# Altium schematic sheet Top_Level.SchDoc: FMC interface to FPGA - Top Level
size A4; Date: 27.09.2023; ApprovedBy: M.Sc. Tobias Wirth; CheckedBy: M.Sc. Tobias Wirth; Author: M.Sc. Tobias Wirth; CompanyName: University of Stuttgart; DrawnBy: M.Sc. Tobias Wirth; Engineer: M.Sc. Tobias Wirth; Organization: IIS; Address1: Pfaffenwaldring 47; Address2: 70569 Stuttgart; Revision: V1.1; SheetNumber: 1; SheetTotal: 17; ProjectNameAlt: AUS - NMR System; Time: 10:00; ImagePath: N/A; Application_BuildNumber: N/A
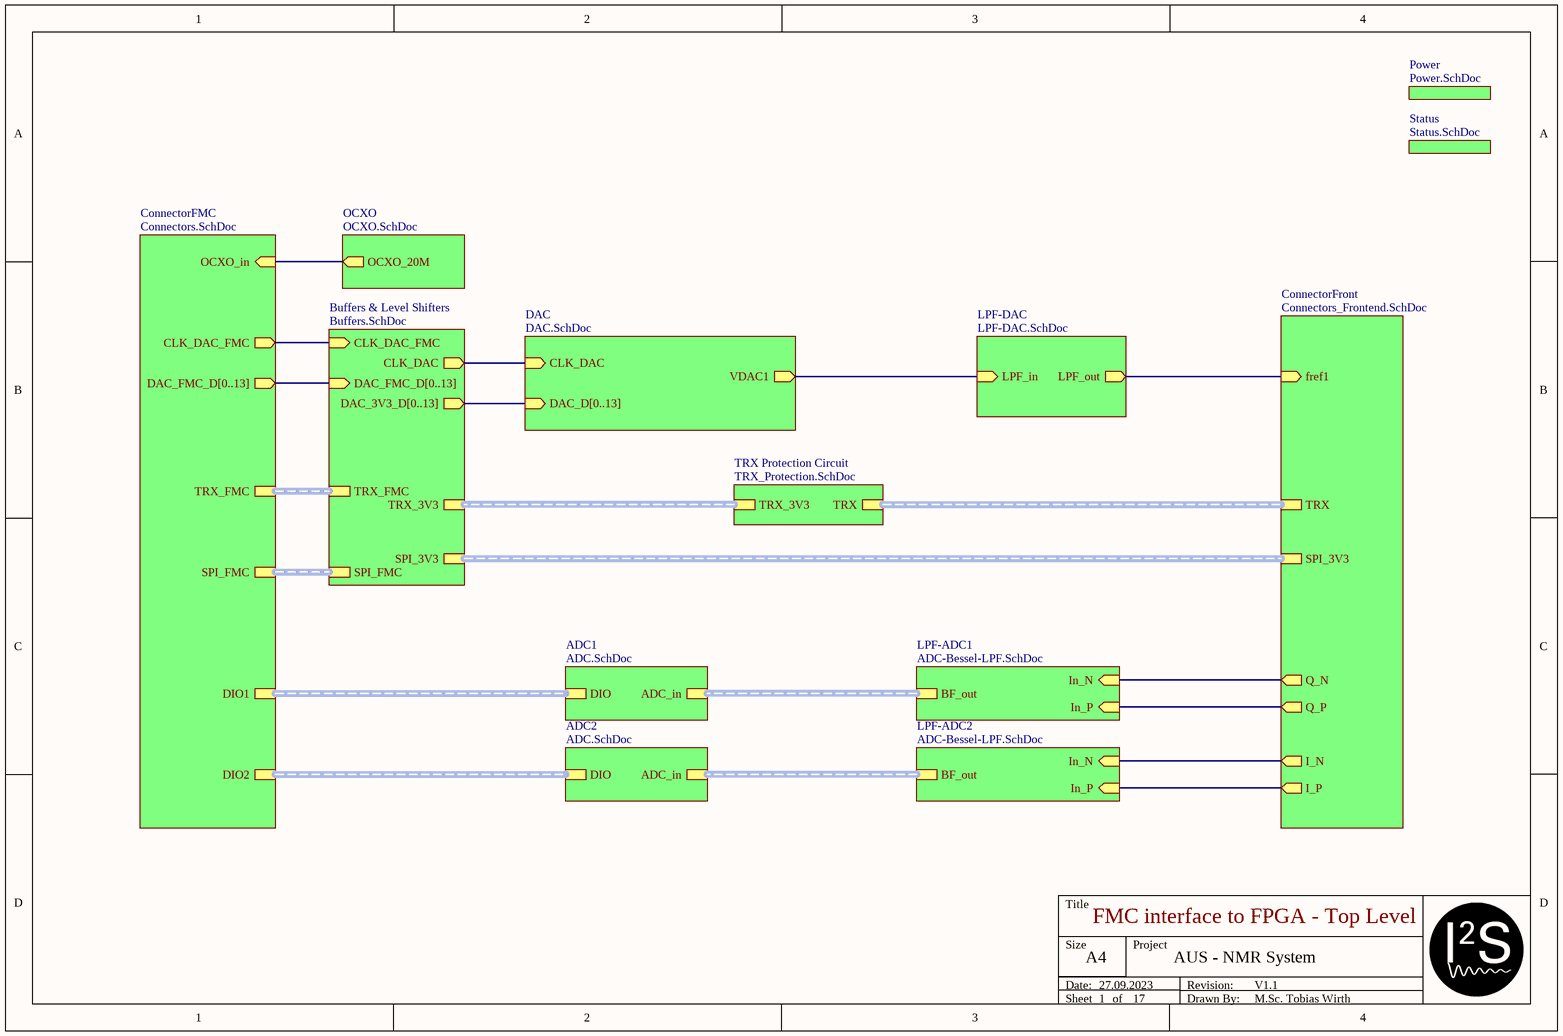
[diagram p0: Top_Level.SchDoc]

## Sub-sheets
ADC1 = ADC.SchDoc: DIO (harness DIO), ADC_in (harness ADC_IN)
ADC2 = ADC.SchDoc: DIO (harness DIO), ADC_in (harness ADC_IN)
Buffers & Level Shifters = Buffers.SchDoc: DAC_FMC_D[0..13] (in), CLK_DAC_FMC (in), TRX_FMC (harness TRX_FMC), SPI_FMC (harness SPI_FMC), CLK_DAC (out), DAC_3V3_D[0..13] (out), TRX_3V3 (harness TRX_3V3), SPI_3V3 (harness SPI_3V3)
ConnectorFMC = Connectors.SchDoc: DIO1 (harness DIO), DIO2 (harness DIO), DAC_FMC_D[0..13] (out), CLK_DAC_FMC (out), OCXO_in (in), TRX_FMC (harness TRX_FMC), SPI_FMC (harness SPI_FMC)
ConnectorFront = Connectors_Frontend.SchDoc: fref1 (in), Q_P (out), Q_N (out), I_P (out), I_N (out), TRX (harness TRX), SPI_3V3 (harness SPI_3V3)
DAC = DAC.SchDoc: VDAC1 (out), CLK_DAC (in), DAC_D[0..13] (in)
LPF-ADC1 = ADC-Bessel-LPF.SchDoc: In_N (in), BF_out (harness ADC_IN), In_P (in)
LPF-ADC2 = ADC-Bessel-LPF.SchDoc: In_N (in), BF_out (harness ADC_IN), In_P (in)
LPF-DAC = LPF-DAC.SchDoc: LPF_out (out), LPF_in (in)
OCXO = OCXO.SchDoc: OCXO_20M (out)
Power = Power.SchDoc: no entries
Status = Status.SchDoc: no entries
TRX Protection Circuit = TRX_Protection.SchDoc: TRX_3V3 (harness TRX_3V3), TRX (harness TRX)

## Nets
(unnamed): sheet ConnectorFMC/CLK_DAC_FMC, sheet Buffers & Level Shifters/CLK_DAC_FMC
(unnamed): sheet ConnectorFMC/OCXO_in, sheet OCXO/OCXO_20M
(unnamed): sheet DAC/VDAC1, sheet LPF-DAC/LPF_in
(unnamed): sheet DAC/CLK_DAC, sheet Buffers & Level Shifters/CLK_DAC
(unnamed): sheet LPF-DAC/LPF_out, sheet ConnectorFront/fref1
(unnamed): sheet ConnectorFront/Q_P, sheet LPF-ADC1/In_P
(unnamed): sheet ConnectorFront/Q_N, sheet LPF-ADC1/In_N
(unnamed): sheet ConnectorFront/I_P, sheet LPF-ADC2/In_P
(unnamed): sheet ConnectorFront/I_N, sheet LPF-ADC2/In_N

## Buses and harness runs
bus sheet Buffers & Level Shifters/DAC_3V3_D[0..13] = sheet DAC/DAC_D[0..13]
bus sheet Buffers & Level Shifters/DAC_FMC_D[0..13] = sheet ConnectorFMC/DAC_FMC_D[0..13]
harness sheet ADC1/ADC_in = sheet LPF-ADC1/BF_out
harness sheet ADC1/DIO = sheet ConnectorFMC/DIO1
harness sheet ADC2/ADC_in = sheet LPF-ADC2/BF_out
harness sheet ADC2/DIO = sheet ConnectorFMC/DIO2
harness sheet Buffers & Level Shifters/SPI_3V3 = sheet ConnectorFront/SPI_3V3
harness sheet Buffers & Level Shifters/SPI_FMC = sheet ConnectorFMC/SPI_FMC
harness sheet Buffers & Level Shifters/TRX_3V3 = sheet TRX Protection Circuit/TRX_3V3
harness sheet Buffers & Level Shifters/TRX_FMC = sheet ConnectorFMC/TRX_FMC
harness sheet ConnectorFront/TRX = sheet TRX Protection Circuit/TRX

## Notes on the sheet
- Title
- Size
- Date:
- Sheet
- A4
- of
- Project
- Drawn By:
- Revision: